# Altium schematic sheet EInkRainGaugePCB.SchDoc
size A3; PageSetup: Record=PageOptions|CenterHorizontal=True|CenterVertical=True|PrintScale=0.73|XCorrection=1.00|YCorrection=1.00|PrintKind=0|BorderSize=5000000|LeftOffset=0|BottomOffset=0|Orientation=2|PaperLength=1000|PaperWidth=1000|Scale=100|PaperSource=7|PrintQuality=-3|MediaType=1|DitherType=10|PrintScaleMode=1|PaperKind=A4|PaperIndex=9
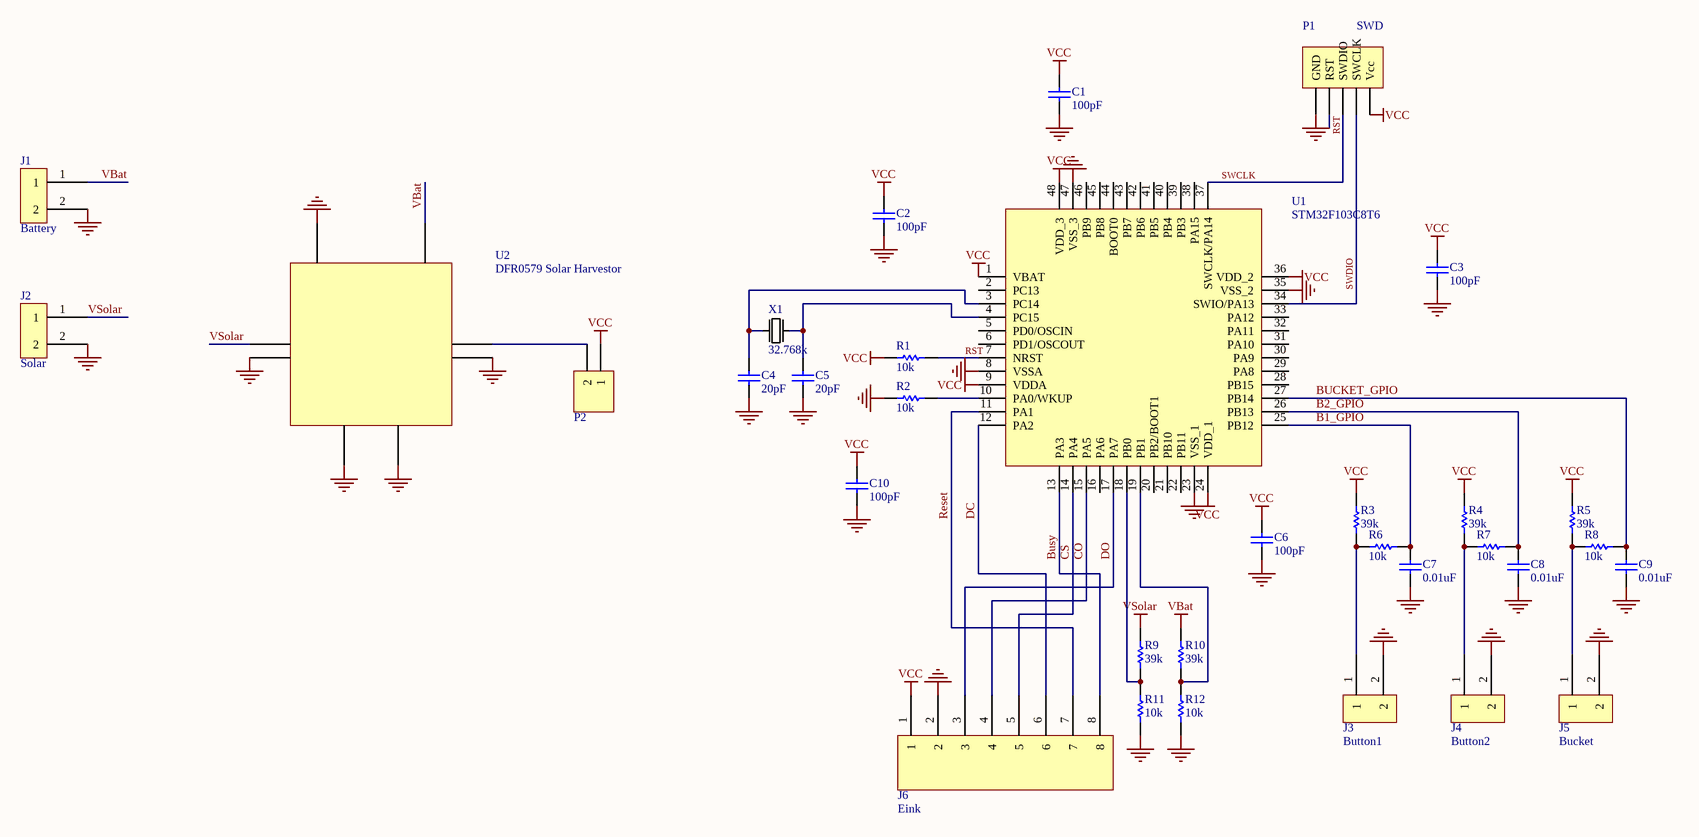
[diagram p0: EInkRainGaugePCB.SchDoc]

## Parts
C1  value 100pF  [Cap SMD 0805A]  (hidden comment: Cap)
C2  value 100pF  [Cap SMD 0805A]  (hidden comment: Cap)
C3  value 100pF  [Cap SMD 0805A]  (hidden comment: Cap)
C4  value 20pF  [Cap SMD 0805A]  (hidden comment: Cap)
C5  value 20pF  [Cap SMD 0805A]  (hidden comment: Cap)
C6  value 100pF  [Cap SMD 0805A]  (hidden comment: Cap)
C7  value 0.01uF  [Cap SMD 0805A]  (hidden comment: Cap)
C8  value 0.01uF  [Cap SMD 0805A]  (hidden comment: Cap)
C9  value 0.01uF  [Cap SMD 0805A]  (hidden comment: Cap)
C10  value 100pF  [Cap SMD 0805A]  (hidden comment: Cap)
J1  Battery  [JST PH 2]
J2  Solar  [JST PH 2]
J3  Button1  [JST PH 2]
J4  Button2  [JST PH 2]
J5  Bucket  [JST PH 2]
J6  Eink  [JST PH 8]
P1  SWD  [HDR1X5]
P2  Power Monitor  [HDR1X2]  (value not drawn)
R1  value 10k  [Res SMD 0805A]  (hidden comment: Res1)
R2  value 10k  [Res SMD 0805A]  (hidden comment: Res1)
R3  value 39k  [Res SMD 0805A]  (hidden comment: Res1)
R4  value 39k  [Res SMD 0805A]  (hidden comment: Res1)
R5  value 39k  [Res SMD 0805A]  (hidden comment: Res1)
R6  value 10k  [Res SMD 0805A]  (hidden comment: Res1)
R7  value 10k  [Res SMD 0805A]  (hidden comment: Res1)
R8  value 10k  [Res SMD 0805A]  (hidden comment: Res1)
R9  value 39k  [Res SMD 0805A]  (hidden comment: Res1)
R10  value 39k  [Res SMD 0805A]  (hidden comment: Res1)
R11  value 10k  [Res SMD 0805A]  (hidden comment: Res1)
R12  value 10k  [Res SMD 0805A]  (hidden comment: Res1)
U1  STM32F103C8T6  [LQFP48]
U2  DFR0579 Solar Harvestor  [DFR0579 Solar Harvester]
X1  value 32.768k  [Crystal - Cylinder]  (hidden comment: XTAL)

## Nets
GND: C1.1 C2.1 C3.1 C4.1 C5.1 C6.1 C7.1 C8.1 C9.1 C10.1 J1.2 J2.2 J3.2 J4.2 J5.2 J6.2 P1.5(GND) R2.2 R11.2 R12.2 U1.8(VSSA) U1.23(VSS_1) U1.35(VSS_2) U1.47(VSS_3) U2.2(SolarIn_-) U2.4(Out_3v3_-) U2.6(BatIn-) U2.7(GND) U2.8(GND)
VBat: J1.1 R10.1 U2.5(BatIn+)
VCC: C1.2 C2.2 C3.2 C6.2 C10.2 J6.1 P1.1(Vcc) P2.1 R1.2 R3.1 R4.1 R5.1 U1.1(VBAT) U1.9(VDDA) U1.24(VDD_1) U1.36(VDD_2) U1.48(VDD_3)
VSolar: J2.1 R9.1 U2.1(SolarIn_+)
B1_GPIO: C7.2 R6.2 U1.25(PB12)
B2_GPIO: C8.2 R7.2 U1.26(PB13)
BUCKET_GPIO: C9.2 R8.2 U1.27(PB14)
Busy: J6.8 U1.13(PA3)
CO: J6.4 U1.15(PA5)
CS: J6.5 U1.14(PA4)
DC: J6.6 U1.12(PA2)
DO: J6.3 U1.17(PA7)
Reset: J6.7 U1.11(PA1)
RST: P1.4(RST) R1.1 U1.7(NRST)
SWCLK: P1.3(SWDIO) U1.37(SWCLK/PA14)
SWDIO: P1.2(SWCLK) U1.34(SWIO/PA13)
NetC4_2: C4.2 U1.3(PC14) X1.2
NetC5_2: C5.2 U1.4(PC15) X1.1
NetJ3_1: J3.1 R3.2 R6.1
NetJ4_1: J4.1 R4.2 R7.1
NetJ5_1: J5.1 R5.2 R8.1
NetP2_2: P2.2 U2.3(Out_3v3_+)
NetR2_1: R2.1 U1.10(PA0/WKUP)
NetR9_2: R9.2 R11.1 U1.18(PB0)
NetR10_2: R10.2 R12.1 U1.19(PB1)

Not connected (* = marked no-connect by the designer): U1 2(PC13) 5(PD0/OSCIN) 6(PD1/OSCOUT) 16(PA6) 20(PB2/BOOT1) 21(PB10) 22(PB11) 28(PB15) 29(PA8) 30(PA9) 31(PA10) 32(PA11) 33(PA12) 38(PA15) 39(PB3) 40(PB4) 41(PB5) 42(PB6) 43(PB7) 44(BOOT0) 45(PB8) 46(PB9)

## Library data of the parts
C1-C10 = Cap: Capacitor; Published: 8-Jun-2000; LatestRevisionDate: 17-Jul-2002; LatestRevisionNote: Re-released for DXP Platform.; PackageReference: RAD-0.3; Publisher: Altium Limited; PackageDescription: Radial Cap, Thru-Hole; 2 Leads; 0.3 in Pin Spacing
J1-J5 = SIP2 CONNECTOR
J6 = SIP8 CONNECTOR
P1 = Header 5: Header, 5-Pin; LatestRevisionDate: 17-Jul-2002; LatestRevisionNote: Re-released for DXP Platform.; Publisher: Altium Limited
P2 = Header 2: Header, 2-Pin; LatestRevisionDate: 17-Jul-2002; LatestRevisionNote: Re-released for DXP Platform.; Publisher: Altium Limited
R1-R12 = Resistor
X1 = Crystal